# Altium project 28Pins_Project_V1I1.PrjPcb (part 3 of 3)
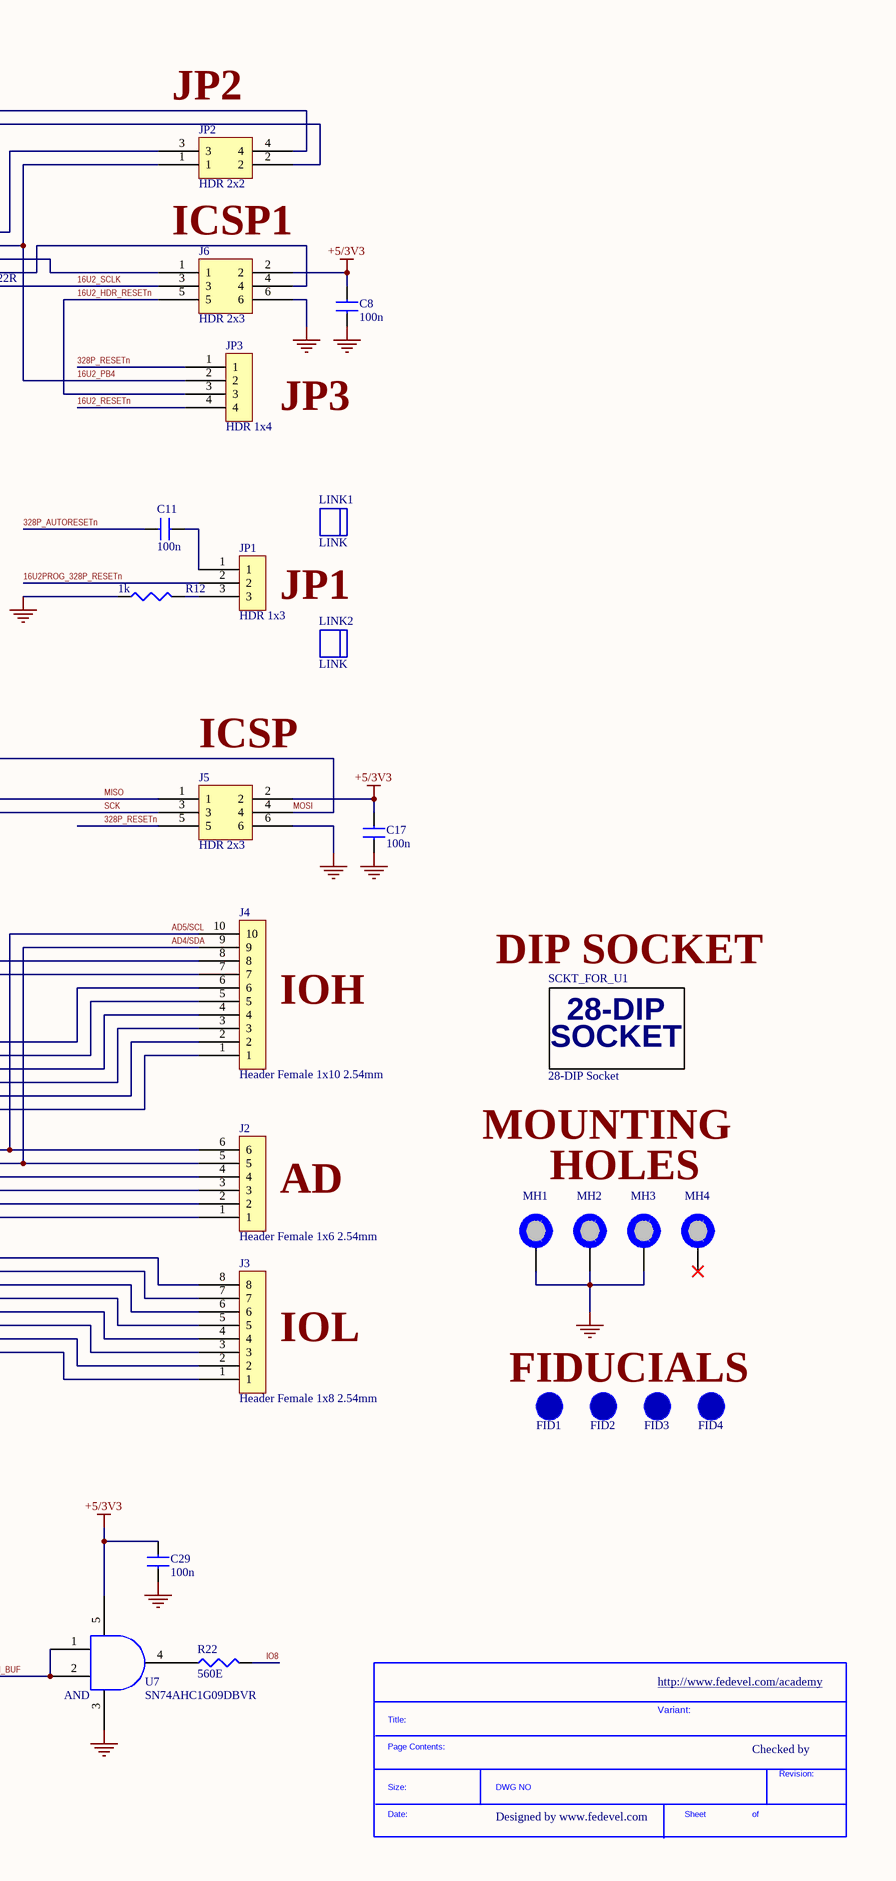
[diagram p4: [03] - 28PINS SCHEMATIC.SchDoc, right]

## Sheet [03] - 28PINS SCHEMATIC.SchDoc: 28Pins (continued)

### Library data of the parts (continued)
U1 = ATMEGA328P-PU: ATMEGA328P-PU; 8 bit Microcontroller AVR 20MHz 1; 32kb Flash; 2kb RAM; I2C SPI 2; Manufacturer: Microchip / Atmel; Number of PWM Channels: 6; Number of Timers/Counters: 3; Min Supply Voltage: 1.8V; Max Supply Voltage: 5.5V; Interface: I2C,SPI,UART,USART,2-Wire; Number of I/Os: 23; Oscillator Type: Internal; Data Bus Width: 8b; Number of SPI Channels: 1; Watchdog Timer: Yes; Peripherals: Brown-out Detect/Reset,POR,PWM,WDT; Supplier 1: Digi-Key; Manufacturer Part Number: ATMEGA328P-PU; Stock 1: 3069; Pricing 1: 1=2.08, 25=1.91, 100=1.73 (USD); Mount: Through Hole; Case/Package: PDIP; Number of Pins: 28; Contact Plating: Tin,Matte; Min Operating Temperature: -40°C; Max Operating Temperature: 85°C; Package Quantity: 14; Core Architecture: AVR; RAM Size: 2KB; Number of ADC Channels: 6; Packaging: Rail/Tube; Frequency: 20MHz; Number of Programmable I/O: 23; Max Frequency: 20MHz; Number of I2C Channels: 1; Memory Type: FLASH; Memory Size: 32KB; Length: 37.4mm; Height: 3.28mm; Width: 6.76mm; Radiation Hardening: No; REACH SVHC: No SVHC; Lead Free: Lead Free; ComponentLink1URL: http://www.farnell.com/datasheets/2047852.pdf?src-supplier=Element14; ComponentLink1Description: http://www.farnell.com/datasheets/2047852.pdf?src-supplier=Element14; ComponentLink2URL: http://www.rapidonline.com/pdf/73-4283.pdf?src-supplier=Rapid+Electronics; ComponentLink2Description: http://www.rapidonline.com/pdf/73-4283.pdf?src-supplier=Rapid+Electronics; ComponentLink3URL: http://www.microchip.com/mymicrochip/filehandler.aspx?ddocname=en589968&src-supplier=Verical; ComponentLink3Description: http://www.microchip.com/mymicrochip/filehandler.aspx?ddocname=en589968&src-supplier=Verical; ComponentLink4URL: http://www.microchip.com/mymicrochip/filehandler.aspx?ddocname=en589968&src-supplier=Jameco; ComponentLink4Description: http://www.microchip.com/mymicrochip/filehandler.aspx?ddocname=en589968&src-supplier=Jameco; ComponentLink5URL: http://datasheet.iiic.cc/atmel/ATMEGA328P-PU.pdf?src-supplier=IIIC; ComponentLink5Description: http://datasheet.iiic.cc/atmel/ATMEGA328P-PU.pdf?src-supplier=IIIC; ComponentLink6URL: http://www.produktinfo.conrad.com/datenblaetter/150000-174999/155197-da-01-en-MICROCONTR_ATMEGA328P_PU_8BIT_PDIP_28.pdf?src-supplier=Conrad; ComponentLink6Description: http://www.produktinfo.conrad.com/datenblaetter/150000-174999/155197-da-01-en-MICROCONTR_ATMEGA328P_PU_8BIT_PDIP_28.pdf?src-supplier=Conrad; Supplier Part Number 1: ATMEGA328P-PU-ND
U2 = ATMEGA16U2-AU: MCU 8-bit ATmega AVR RISC 16KB Flash 3.3V/5V 32-Pin TQFP; Manufacturer: Microchip; Interface: SPI,USB,UART,USART; Peripherals: Brown-out Detect/Reset,POR,PWM,WDT; Frequency: 16MHz; Number of I/Os: 22; Oscillator Type: Internal; Supplier 1: Digi-Key; Manufacturer Part Number: ATMEGA16U2-AU; Stock 1: 3974; Pricing 1: 1=2.45, 25=2.25, 100=2.04 (USD); Case/Package: TQFP; Number of Pins: 32; Min Operating Temperature: -40°C; Max Operating Temperature: 85°C; Core Architecture: AVR; Memory Type: FLASH; Packaging: Tray; Memory Size: 16KB; Supplier Part Number 1: ATMEGA16U2-AU-ND
U3 = TL1963A-33DCQR: IC REG LINEAR 3.3V 1.5A SOT223-6; Manufacturer: Texas Instruments; Dropout Voltage: 340mV; Number of Outputs: 1; Max Input Voltage: 20V; Min Input Voltage: 2.1V; Min Current Limit: 1.6A; Input Bias Current: 1mA; Polarity: Positive; Accuracy: 3%; Output Type: Fixed; Supplier 1: Digi-Key; Manufacturer Part Number: TL1963A-33DCQR; Stock 1: 2998; Pricing 1: 1=2.8, 10=2.513, 25=2.376, 100=1.9536, 250=1.753, 500=1.6896, 1000=1.4045 (USD); Case/Package: SOT-223; Number of Pins: 6; Contact Plating: Gold; Min Operating Temperature: -40°C; Max Operating Temperature: 125°C; Package Quantity: 1; Packaging: Tape and Reel; Output Voltage: 3.3V; Output Current: 1.5A; Max Output Current: 1.5A; Number of Regulators: 1; Quiescent Current: 1mA; Max Output Voltage: 3.3V; Min Output Voltage: 3.3V; Radiation Hardening: No; Lead Free: Lead Free; ComponentLink1URL: http://www.ti.com/lit/ds/symlink/tl1963a.pdf?src-supplier=Digi-Key; ComponentLink1Description: http://www.ti.com/lit/ds/symlink/tl1963a.pdf?src-supplier=Digi-Key; ComponentLink2URL: http://www.ti.com/lit/ds/symlink/tl1963a.pdf?src-supplier=Avnet+Europe; ComponentLink2Description: http://www.ti.com/lit/ds/symlink/tl1963a.pdf?src-supplier=Avnet+Europe; Supplier Part Number 1: 296-24534-1-ND
U4-U7 = SN74AHC1G09DBVR: TEXAS INSTRUMENTS - SN74AHC1G09DBVR - AND Gate, 74AHC1G09, 2 Input, 2 V to 5.5 V, SOT-23-5; Output Voltage: 5.5V; Number of Inputs: 2; Propagation Delay: 7.5ns; Min Supply Voltage: 2V; Output Current: 25mA; Number of Outputs: 1; Quiescent Current: 1uA; Low Level Output Current: 8mA; Supplier 1: Digi-Key; Manufacturer: Texas Instruments; Manufacturer Part Number: SN74AHC1G09DBVR; Stock 1: 30971; Pricing 1: 1=0.32, 10=0.24, 25=0.21, 100=0.1359, 250=0.1125, 500=0.09, 1000=0.069 (USD); Mount: Surface Mount; Case/Package: SOT-23; Number of Pins: 5; Contact Plating: Tin,Matte; Min Operating Temperature: -55°C; Max Operating Temperature: 125°C; Package Quantity: 3000; Packaging: Tape and Reel; Max Supply Voltage: 5.5V; Logic Function: AND; Number of Circuits: 1; Number of Gates: 1; Number of Elements: 1; Number of Bits: 1; Radiation Hardening: No; REACH SVHC: No SVHC; Lead Free: Lead Free; ComponentLink1URL: http://www.ti.com/lit/ds/symlink/sn74ahc1g09.pdf?src-supplier=Digi-Key; ComponentLink1Description: http://www.ti.com/lit/ds/symlink/sn74ahc1g09.pdf?src-supplier=Digi-Key; Supplier Part Number 1: 296-29202-1-ND
Y1 Y2 = ABM7-16.000MHZ-D2Y-T: CRYSTAL 16.0000MHZ 18PF SMD; Manufacturer: Abracon; Frequency Tolerance: 20ppm; ESR (Equivalent Series Resistance): 50R; Frequency: 16MHz; Frequency Stability: 30ppm; Supplier 1: Digi-Key; Manufacturer Part Number: ABM7-16.000MHZ-D2Y-T; Stock 1: 65890; Pricing 1: 1=1, 10=0.886, 50=0.8278, 100=0.7315, 500=0.693 (USD); Mount: Surface Mount; Case/Package: CSMD; Number of Pins: 2; Min Operating Temperature: -40°C; Max Operating Temperature: 85°C; Load Capacitance: 18pF; Package Quantity: 1000; Tolerance: 20ppm; Packaging: Tape and Reel; Termination: SMD/SMT; Composition: Ceramic; Length: 6mm; Height: 0.055inch; Width: 3.3mm; Depth: 3.5mm; Radiation Hardening: No; REACH SVHC: Unknown; Lead Free: Lead Free; ComponentLink1URL: https://www.verical.com/server-webapp/html/getDatasheet?partID=721624&src-supplier=Verical; ComponentLink1Description: https://www.verical.com/server-webapp/html/getDatasheet?partID=721624&src-supplier=Verical; ComponentLink2URL: http://www.farnell.com/datasheets/947971.pdf?src-supplier=Element14; ComponentLink2Description: http://www.farnell.com/datasheets/947971.pdf?src-supplier=Element14; ComponentLink3URL: http://www.abracon.com/Resonators/abm7.pdf?src-supplier=Farnell; ComponentLink3Description: http://www.abracon.com/Resonators/abm7.pdf?src-supplier=Farnell; ComponentLink4URL: http://www.abracon.com/Resonators/abm7.pdf?src-supplier=Future+Electronics; ComponentLink4Description: http://www.abracon.com/Resonators/abm7.pdf?src-supplier=Future+Electronics; ComponentLink5URL: https://abracon.com/Resonators/abm7.pdf?src-supplier=Digi-Key; ComponentLink5Description: https://abracon.com/Resonators/abm7.pdf?src-supplier=Digi-Key; ComponentLink6URL: http://www.abracon.com/Support/PackageDrawing/Resonators/ABM7.PDF?src-supplier=Verical; ComponentLink6Description: http://www.abracon.com/Support/PackageDrawing/Resonators/ABM7.PDF?src-supplier=Verical; Supplier Part Number 1: 535-9840-1-ND
Z1 Z2 = CG0603MLC-05E: VARISTOR 0603; Manufacturer: Bourns; Capacitance: 0.5pF; Voltage Rating (DC): 5V; Number of Channels: 1; Clamping Voltage: 20V; Current Rating: 50nA; Voltage Rating (AC): 8V; Turn-On Delay Time: 1ns; Element Configuration: Single; Supplier 1: Digi-Key; Manufacturer Part Number: CG0603MLC-05E; Stock 1: 112494; Pricing 1: 1=0.1, 25=0.066, 100=0.0643 (USD); Case/Package: 0603; Number of Pins: 2; Case Code (Imperial): 0603; Case Code (Metric): 1608; Contact Plating: Tin; Min Operating Temperature: -40°C; Max Operating Temperature: 85°C; Operating Supply Voltage: 5V; Package Quantity: 1; Packaging: Tape and Reel; Termination: SMD/SMT; Voltage: 5V; Number of Circuits: 1; Max Voltage Rating (DC): 5V; Working Voltage: 5V; Leakage Current: 50nA; Length: 1.6mm; Width: 0.8mm; Depth: 0.8mm; Thickness: 0.8mm; Radiation Hardening: No; REACH SVHC: No SVHC; ComponentLink1URL: https://www.bourns.com/docs/Product-Datasheets/MLC.pdf?src-supplier=Digi-Key; ComponentLink1Description: https://www.bourns.com/docs/Product-Datasheets/MLC.pdf?src-supplier=Digi-Key; ComponentLink2URL: http://www.farnell.com/datasheets/2360367.pdf?src-supplier=Element14; ComponentLink2Description: http://www.farnell.com/datasheets/2360367.pdf?src-supplier=Element14; ComponentLink3URL: http://www.jameco.com/Jameco/Products/ProdDS/1163231.pdf?src-supplier=Jameco; ComponentLink3Description: http://www.jameco.com/Jameco/Products/ProdDS/1163231.pdf?src-supplier=Jameco; ComponentLink4URL: http://www.bourns.com/docs/Product-Datasheets/MLC.pdf?src-supplier=Avnet+Europe; ComponentLink4Description: http://www.bourns.com/docs/Product-Datasheets/MLC.pdf?src-supplier=Avnet+Europe; ComponentLink5URL: http://www.bourns.com/docs/Product-Datasheets/MLC.pdf?src-supplier=Avnet; ComponentLink5Description: http://www.bourns.com/docs/Product-Datasheets/MLC.pdf?src-supplier=Avnet; Supplier Part Number 1: CG0603MLC-05ECT-ND

## Assembly variants
FIXED 5V: not fitted JP2 JP4 LINK3 R26 R28
5V/3V3: not fitted JP2 R26 R27 R28; alternate parts Y1 -> ABM7-10.000MHZ-D2Y-T, Y2 -> ABM7-8.000MHZ-D2Y-T